# EAGLE design AJH_100m_ADSR_1_0 (EAGLE 9.5.2)
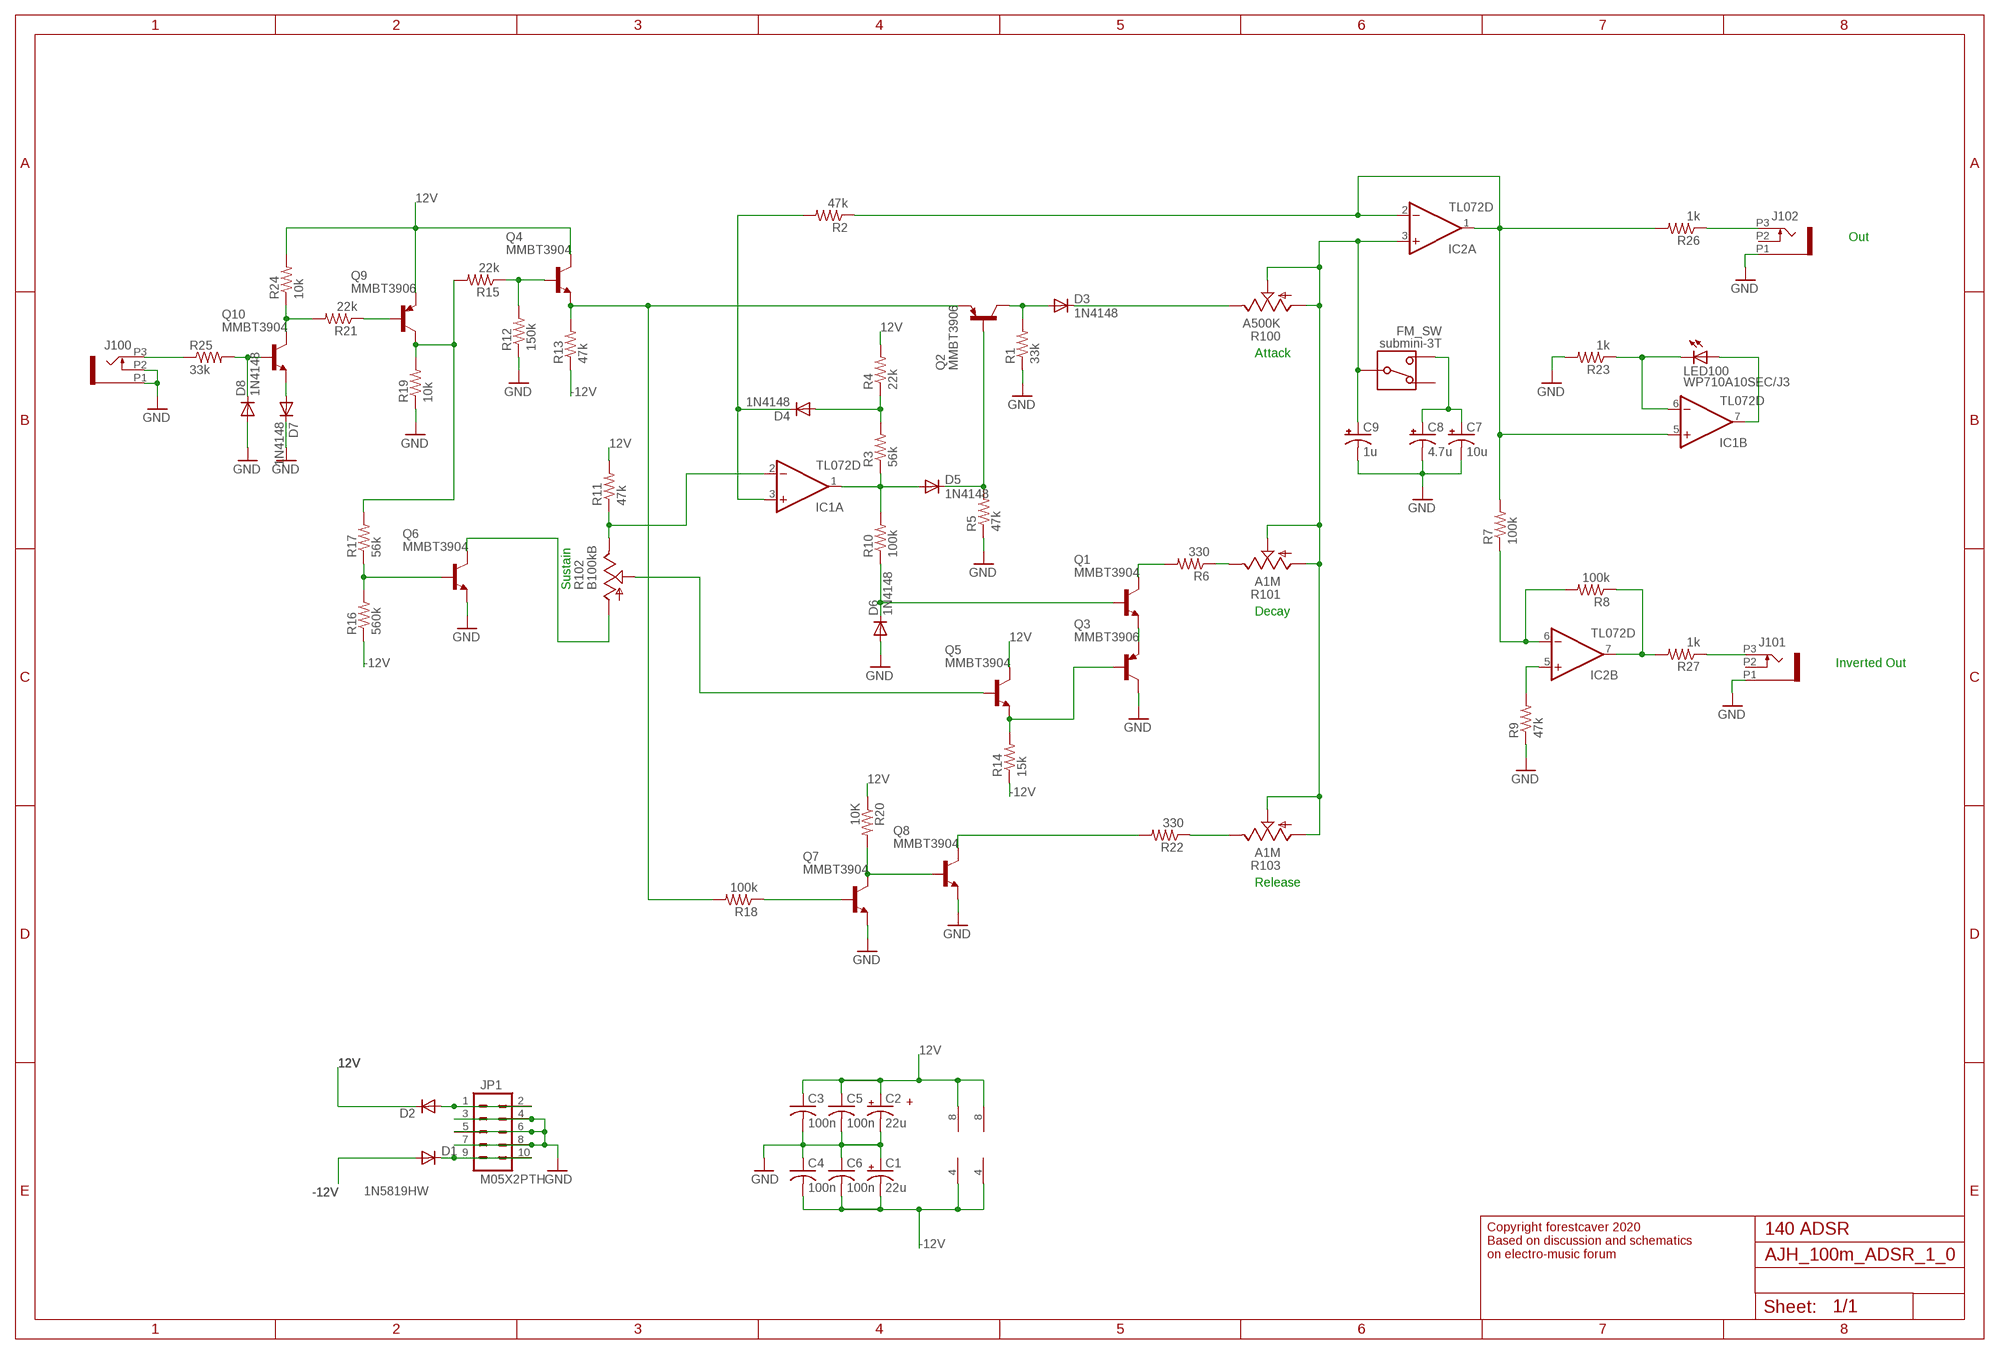
[diagram p0: schematic, sheet 1]

## Parts
C1  22u  CPOL-USB  [PANASONIC_B]
C2  22u  CPOL-USB  [PANASONIC_B]
C3  100n  C-USC0603  [C0603]
C4  100n  C-USC0603  [C0603]
C5  100n  C-USC0603  [C0603]
C6  100n  C-USC0603  [C0603]
C7  10u  CPOL-USB  [PANASONIC_B]
C8  4.7u  CPOL-USB  [PANASONIC_B]
C9  1u  CPOL-USB  [PANASONIC_B]
D1  1N5819HW  DIODE-SOD123  [SOD123]
D2  1N5819HW  DIODE-SOD123  [SOD123]
D3  1N4148  DIODE-SOD323-W  [SOD323-W]
D4  1N4148  DIODE-SOD323-W  [SOD323-W]
D5  1N4148  DIODE-SOD323-W  [SOD323-W]
D6  1N4148  DIODE-SOD323-W  [SOD323-W]
D7  1N4148  DIODE-SOD323-W  [SOD323-W]
D8  1N4148  DIODE-SOD323-W  [SOD323-W]
FM_SW  submini-3T  SPDTT  [SPDT-SUB]
IC1  TL072D  [SO08]
IC2  TL072D  [SO08]
J100  PJ301_THONKICONN6  [WQP_PJ_301M6]
J101  PJ301_THONKICONN6  [WQP_PJ_301M6]
J102  PJ301_THONKICONN6  [WQP_PJ_301M6]
JP1  M05X2PTH  [AVR_ICSP]
LED100  WP710A10SEC/J3  LED3MM  [LED3MM]
Q1  MMBT3904  MMBT3904LT1-NPN-SOT23-BEC  [SOT23-BEC]
Q2  MMBT3906  MMBT3906LT1-PNP-SOT23-BEC  [SOT23-BEC]
Q3  MMBT3906  MMBT3906LT1-PNP-SOT23-BEC  [SOT23-BEC]
Q4  MMBT3904  MMBT3904LT1-NPN-SOT23-BEC  [SOT23-BEC]
Q5  MMBT3904  MMBT3904LT1-NPN-SOT23-BEC  [SOT23-BEC]
Q6  MMBT3904  MMBT3904LT1-NPN-SOT23-BEC  [SOT23-BEC]
Q7  MMBT3904  MMBT3904LT1-NPN-SOT23-BEC  [SOT23-BEC]
Q8  MMBT3904  MMBT3904LT1-NPN-SOT23-BEC  [SOT23-BEC]
Q9  MMBT3906  MMBT3906LT1-PNP-SOT23-BEC  [SOT23-BEC]
Q10  MMBT3904  MMBT3904LT1-NPN-SOT23-BEC  [SOT23-BEC]
R1  33k  R-US_R0603  [R0603]
R2  47k  R-US_R0603  [R0603]
R3  56k  R-US_R0603  [R0603]
R4  22k  R-US_R0603  [R0603]
R5  47k  R-US_R0603  [R0603]
R6  330  R-US_R0603  [R0603]
R7  100k  R-US_R0603  [R0603]
R8  100k  R-US_R0603  [R0603]
R9  47k  R-US_R0603  [R0603]
R10  100k  R-US_R0603  [R0603]
R11  47k  R-US_R0603  [R0603]
R12  150k  R-US_R0603  [R0603]
R13  47k  R-US_R0603  [R0603]
R14  15k  R-US_R0603  [R0603]
R15  22k  R-US_R0603  [R0603]
R16  560k  R-US_R0603  [R0603]
R17  56k  R-US_R0603  [R0603]
R18  100k  R-US_R0603  [R0603]
R19  10k  R-US_R0603  [R0603]
R20  10K  R-US_R0603  [R0603]
R21  22k  R-US_R0603  [R0603]
R22  330  R-US_R0603  [R0603]
R23  1k  R-US_R0603  [R0603]
R24  10k  R-US_R0603  [R0603]
R25  33k  R-US_R0603  [R0603]
R26  1k  R-US_R0603  [R0603]
R27  1k  R-US_R0603  [R0603]
R100  A500K  POT_USVERTICAL  [ALPS_POT_VERTICAL]
R101  A1M  POT_USVERTICAL  [ALPS_POT_VERTICAL]
R102  B100kB  POT_USVERTICAL  [ALPS_POT_VERTICAL]
R103  A1M  POT_USVERTICAL  [ALPS_POT_VERTICAL]

## Nets
12V [power]: C2.+ C3.1 C5.1 D2.C IC1.8(P:V+) IC2.8(P:V+) Q4.C Q5.C Q9.E R4.2 R11.2 R20.1 R24.2
-12V [power]: C1.- C4.2 C6.2 D1.A IC1.4(P:V-) IC2.4(P:V-) R13.1 R14.1 R16.1
GND [power]: C1.+ C2.- C3.2 C4.1 C5.2 C6.1 C7.- C8.- C9.- D6.A D7.C D8.A J100.P1 J100.P2 J101.P1 J102.P1 JP1.3 JP1.4 JP1.5 JP1.6 JP1.7 JP1.8 Q3.C Q6.E Q7.E Q8.E R1.1 R5.1 R9.1 R12.1 R19.1 R23.2
N$1: IC1.6(B:-IN) LED100.K(C) R23.1
N$2: IC2.6(B:-IN) R7.1 R8.2
N$3: D4.A R3.2 R4.1
N$4: IC1.7(B:OUT) LED100.A
N$6: D2.A JP1.1 JP1.2
N$9: C7.+ C8.+ FM_SW.P$1
N$10: IC1.5(B:+IN) IC2.1(A:OUT) IC2.2(A:-IN) R2.1 R7.2 R26.2
N$11: J102.P3 R26.1
N$13: IC2.7(B:OUT) R8.1 R27.2
N$14: J100.P3 R25.1
N$15: IC2.5(B:+IN) R9.2
N$16: D8.C Q10.B R25.2
N$17: D7.A Q10.E
N$18: Q10.C R21.2 R24.1
N$19: Q9.B R21.1
N$20: D1.C JP1.9 JP1.10
N$21: Q9.C R15.2 R17.2 R19.2
N$23: Q2.E Q4.E R13.2 R18.2
N$24: Q4.B R12.2 R15.1
N$25: Q6.C R102.P$3(A)
N$26: Q6.B R16.2 R17.1
N$27: IC1.2(A:-IN) R11.1 R102.P$1(E)
N$28: D4.C IC1.3(A:+IN) R2.2
N$29: Q5.B R102.P$2(S)
N$30: D3.A Q2.C R1.2
N$31: D5.C Q2.B R5.2
N$32: D5.A IC1.1(A:OUT) R3.1 R10.2
N$33: D6.C Q1.B R10.1
N$34: Q1.E Q3.E
N$35: Q1.C R6.2
N$36: D3.C R100.P$1(E)
N$37: Q3.B Q5.E R14.2
N$38: C9.+ FM_SW.P$2 IC2.3(A:+IN) R100.P$2(S) R100.P$3(A) R101.P$2(S) R101.P$3(A) R103.P$2(S) R103.P$3(A)
N$40: J101.P3 R27.1
N$56: R6.1 R101.P$1(E)
N$57: Q7.C Q8.B R20.2
N$58: Q8.C R22.2
N$59: Q7.B R18.1
N$60: R22.1 R103.P$1(E)
Unconnected: FM_SW.P$3 J101.P2 J102.P2

## Notes on the sheet
- Out
- Attack
- Sustain
- Decay
- Inverted Out
- Release
- +
- Copyright forestcaver 2020
  Based on discussion and schematics
  on electro-music forum
- 140 ADSR

## Library data of the parts
C1 C2 C7-C9 = rcl:CPOL-US: POLARIZED CAPACITOR, American symbol
C3-C6 = rcl:C-US: CAPACITOR, American symbol
D1-D8 = diode:DIODE-: DIODE
FM_SW = malekko main:SPDT: SPDT Switch
IC1 IC2 = linear:TL072: OP AMP
J100-J102 = og-pj301_variations:PJ301_THONKICONN
JP1 = og-header:M05X2: Header 5x2 Standard 10-pin dual row 0.1" header. Commonly used with AVR-ISP. Use with Spark Fun Electronics SKU: PRT-00778
LED100 = led:LED: LED OSRAM: - CHIPLED LG R971, LG N971, LY N971, LG Q971, LY Q971, LO R971, LY R971 LH N974, LH R974 LS Q976, LO Q976, LY Q976 LO Q996 - Hyper CHIPLED LW Q18S LB Q993, LB Q99A, LB R99A - SideLED LS A670, LO A670, LY A670, LG A670, LP A670 LB A673, LV A673, LT A673, LW A673 LH A674 LY A675 LS A676, LA A676, LO A676, LY A676, LW A676 LS A679, LY A679, LG A679 - Hyper Micro SIDELED® LS Y876, LA Y876, LO Y876, LY Y876 LT Y87S - SmartLED LW L88C, LW L88S LB L89C, LB L89S, LG L890 LS L89K, LO L89K, LY L89K LS L896, LA L896, LO L896, LY L896 - TOPLED LS T670, LO T670, LY T670, LG T670, LP T670 LSG T670, LSP T670, LSY T670, LOP T670, LYG T670 LG T671, LOG T671, LSG T671 LB T673, LV T673, LT T673, LW T673 LH T674 LS T676, LA T676, LO T676, LY T676, LB T676, LH T676, LSB T676, LW T676 LB T67C, LV T67C, LT T67C, LS T67K, LO T67K, LY T67K, LW E67C LS E67B, LA E67B, LO E67B, LY E67B, LB E67C, LV E67C, LT E67C LW T67C LS T679, LY T679, LG T679 LS T770, LO T770, LY T770, LG T770, LP T770 LB T773, LV T773, LT T773, LW T773 LH T774 LS E675, LA E675, LY E675, LS T675 LS T776, LA T776, LO T776, LY T776, LB T776 LHGB T686 LT T68C, LB T68C - Hyper Mini TOPLED® LB M676 - Mini TOPLED Santana® LG M470 LS M47K, LO M47K, LY M47K Source: http://www.osram.convergy.de LUXEON: - LUMILED® LXK2-PW12-R00, LXK2-PW12-S00, LXK2-PW14-U00, LXK2-PW14-V00 LXK2-PM12-R00, LXK2-PM12-S00, LXK2-PM14-U00 LXK2-PE12-Q00, LXK2-PE12-R00, LXK2-PE12-S00, LXK2-PE14-T00, LXK2-PE14-U00 LXK2-PB12-K00, LXK2-PB12-L00, LXK2-PB12-M00, LXK2-PB14-N00, LXK2-PB14-P00, LXK2-PB14-Q00 LXK2-PR12-L00, LXK2-PR12-M00, LXK2-PR14-Q00, LXK2-PR14-R00 LXK2-PD12-Q00, LXK2-PD12-R00, LXK2-PD12-S00 LXK2-PH12-R00, LXK2-PH12-S00 LXK2-PL12-P00, LXK2-PL12-Q00, LXK2-PL12-R00 Source: www.luxeon.com KINGBRIGHT: KA-3528ASYC Source: www.kingbright.com
Q1 Q4-Q8 Q10 = transistor:*-NPN-: NPN Transistror BF959 corrected 2008.03.06
Q2 Q3 Q9 = transistor:*-PNP-: PNP Transistror
R1-R22 R24-R27 = resistor:R-US_: RESISTOR, American symbol
R23 = rcl:R-US_: RESISTOR, American symbol
R100-R103 = og-pots:POT_US

## Net classes
0 default: width 0.152 mm
1 power: width 0.406 mm
2 nearfilter: width 0.152 mm

## Board
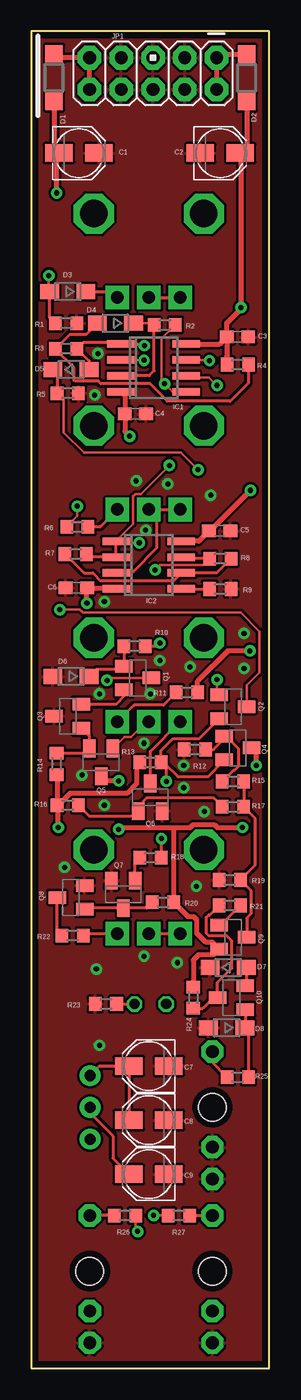
[diagram p1: board, top side]
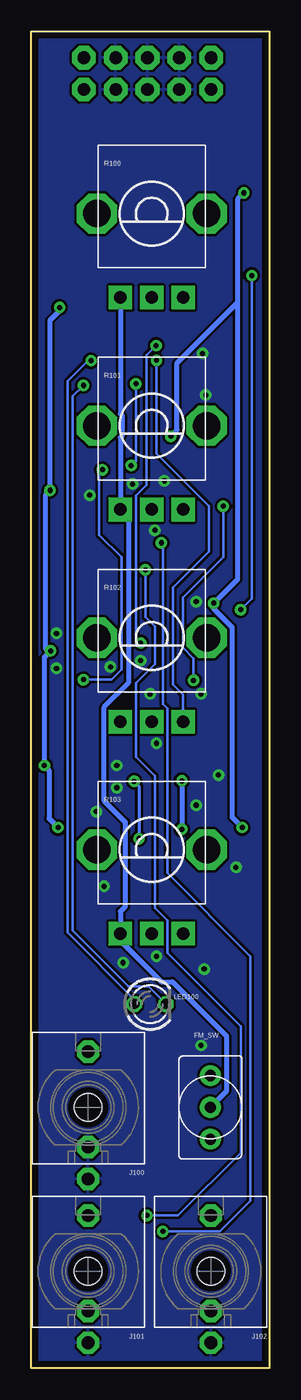
[diagram p2: board, bottom side, seen from below]

Size 19.03 x 106.76 mm. Coordinates in mm from the lower left corner, seen from the top.
Outline: 0,0 19.03,0 19.03,106.76 0,106.76 0,0
Copper layers (1*16): Top 0.035mm / dielectric 1.5mm / Bottom 0.035mm
Design rules "Mutable_PCBCart-Standard": minimum track width 8mil, minimum drill 0.4mm, track to track 8mil, track to pad 8mil, pad to pad 8mil, via to via 8mil, smd to smd 8mil, copper to edge 20mil, drill to drill 8mil, minimum pad ring 8mil, minimum via ring 10mil, stop-mask expansion 3mil, vias tented up to drill 25mil, thermal gap 8mil

### Footprints (pad centres in the part's own frame; a part is rotated, then mirrored left to right if it is on the bottom)
PANASONIC_B = smd 2.2 x 1.4: + 1.6,0; - -1.6,0
C0603 = smd 1.1 x 1: 1 -0.85,0; 2 0.85,0
SOD123 = smd 1.4 x 1.4: A 1.9,0; C -1.9,0
SOD323-W = smd 1.5 x 1.2: A 1.45,0; C -1.45,0
SPDT-SUB = drill 0.889 pad 1.651: P$1 0,2.54; P$2 0,0; P$3 0,-2.54
SO08 = smd 0.6 x 2.2: 1 -1.905,-2.6; 2 -0.635,-2.6; 3 0.635,-2.6; 4 1.905,-2.6; 5 1.905,2.6; 6 0.635,2.6; 7 -0.635,2.6; 8 -1.905,2.6
WQP_PJ_301M6 = drill 1.016 pad 1.778 octagon: P1 0,-5.715; P2 0,-3.175; P3 0,4.445 | hole 2.2: 0,0
AVR_ICSP = drill 1.016 pad 1.88 octagon: 1 -1.27,5.08; 2 1.27,5.08; 3 -1.27,2.54; 4 1.27,2.54; 5 -1.27,0; 6 1.27,0; 7 -1.27,-2.54; 8 1.27,-2.54; 9 -1.27,-5.08; 10 1.27,-5.08
LED3MM = drill 0.813 octagon: A -1.27,0; K 1.27,0
SOT23-BEC = smd 1 x 1.4: B -0.95,-1.1; C 0,1.1; E 0.95,-1.1
R0603 = smd 1 x 1.1: 1 -0.85,0; 2 0.85,0
ALPS_POT_VERTICAL = drill 1 pad 1.88 square: P$1 -2.5,6.7; P$2 0,6.7; P$3 2.5,6.7 | drill 2.2 pad 3.175 octagon: P$4 -4.4,0; P$5 4.4,0

### Placement (x,y rotation side)
C1  3.81,97.03 0 top
C2  15.11,97.03 0 top
C3  16.49,82.35 0 top
C4  8.33,76.2 180 top
C5  15.06,66.87 0 top
C6  3.6,62.31 0 top
C7  9.4,24.13 180 top
C8  9.4,19.81 180 top
C9  9.4,15.49 180 top
D1  1.83,103.06 270 top
D2  17.23,103.04 90 top
D3  2.92,85.98 180 top
D4  6.73,83.44 180 top
D5  3.17,79.76 0 top
D6  3.17,55.24 180 top
D7  15.75,32 0 top
D8  15.62,27.18 180 top
FM_SW  4.7,20.83 0 bottom
IC1  9.78,79.88 270 top
IC2  9.4,64.14 270 top
J100  14.48,20.83 0 bottom
J101  14.48,7.75 0 bottom
J102  4.67,7.75 0 bottom
JP1  9.74,103.38 270 top
LED100  9.53,29.08 0 bottom
Q1  8.51,55.12 270 top
Q2  16.13,52.83 270 top
Q3  2.92,52.07 90 top
Q4  16.51,49.53 270 top
Q5  5.59,48.39 180 top
Q6  9.53,45.59 0 top
Q7  7.37,37.85 180 top
Q8  3.17,37.59 90 top
Q9  16.13,34.42 270 top
Q10  16,29.59 90 top
R1  2.79,83.44 180 top
R2  10.67,83.31 180 top
R3  2.79,81.41 180 top
R4  16.51,80.14 180 top
R5  2.92,77.85 180 top
R6  3.68,67.18 180 top
R7  3.56,65.02 0 top
R8  15.11,64.64 0 top
R9  15.11,62.23 180 top
R10  8.26,57.66 0 top
R11  12.45,53.98 0 top
R12  13.08,49.4 0 top
R13  9.53,48.39 0 top
R14  2.03,48.26 90 top
R15  16.13,46.86 0 top
R16  2.92,44.96 0 top
R17  16.13,44.83 0 top
R18  9.53,40.77 0 top
R19  15.88,38.99 0 top
R20  10.54,37.21 180 top
R21  15.88,36.96 180 top
R22  3.3,34.54 180 top
R23  5.97,29.08 180 top
R24  12.95,29.59 90 top
R25  16.51,23.24 0 top
R26  7.49,12.19 0 top
R27  11.81,12.19 180 top
R100  9.4,92.2 180 bottom
R101  9.4,75.27 180 bottom
R102  9.4,58.34 180 bottom
R103  9.4,41.4 180 bottom

### Tracks (layer width: path | path; a pad name or v marks a point on that pad's centre or on a via)
12V  (via drill 0.4)
  Top 0.406: D2.C 17.23,97.54 C2.+ 16.76,96.98 v16.76,84.71 16.76,84.58 15.64,83.46 C3.1 | IC2.8 13.39,66.04 C5.1 14.29,66.87 v17.53,70.1 | v17.53,70.1 | R11.2 13.3,54.87 15.71,57.28 v17.49,57.28 | v17.99,48.13 17.99,49.15 Q4.C | C3.1 15.64,80.79 15.66,80.77 R4.2 | C3.1 15.08,81.79 IC1.8 | v6.99,46.91 5.96,46.91 Q5.C | v6.99,43.03 7.13,43.18 11.43,43.18 | 11.43,43.18 12.73,43.18 12.96,43.42 14.63,43.42 14.87,43.18 v16.89,43.18 | 11.43,43.18 11.39,43.14 R20.1 12.55,36.05 13.01,36.05 13.24,35.81 13.24,34.73 13.97,34 14.49,34 Q9.E 14.57,33.01 13.38,33.01 12.95,32.59 R24.2
  Bottom 0.406: v16.76,84.71 16.76,84.45 17.53,83.69 v17.53,70.1 17.91,69.72 17.91,57.49 17.69,57.28 v17.49,57.28 17.99,56.77 v17.99,48.13 17.61,47.75 17.61,43.9 v16.89,43.18 | v6.99,46.91 v6.99,43.03
-12V  (via drill 0.4)
  Top 0.406: D1.A 1.83,97.41 C1.- 2.03,96.85 v2.03,93.85 | IC1.4 7.48,77.68 C4.2 7.49,76.19 7.49,74.8 v7.87,74.42 | IC2.4 6.71,62.31 C6.2 v4.45,61.09 | R14.1 2.07,47.37 R16.1 2.15,44.96 | R13.1 8.42,48.13 8.42,46.69 7.64,45.91 3.1,45.91 2.15,44.96 | v2.16,43.18 2.15,43.19 2.15,44.96
  Bottom 0.406: 2.54,85.09 7.37,80.26 7.37,74.93 v7.87,74.42 | v2.03,93.85 2.54,93.34 2.54,85.09 | 2.54,85.09 2.54,62.99 v4.45,61.09 4.45,60.63 2.98,59.17 2.98,44.01 v2.16,43.18
GND  (via drill 0.41)
  other vias: 2.67,40.01 12.19,46.35 13.84,44.45 5.21,31.88 5.46,25.78 11.68,32.38 9.02,32.89 12.19,48.13 14.35,69.72 8.38,70.87 5.84,61.21 17.02,58.67 17.02,55.88 10.29,56.52 4.06,47.37 5.08,77.72 13.21,38.48 12.7,56.01 5.46,53.85 9.14,66.93 5.33,81.03 9.02,49.91 5.84,44.96 9.53,53.85 10.92,70.61
  pour Top: -0.89,107.7 19.43,107.7 20.07,107.06 20.32,106.81 20.32,-0.25 19.3,-1.27 -0.25,-1.27 -0.89,-0.64
  pour Bottom: -1.4,108.33 20.07,108.33 20.07,-0.64 -1.14,-0.64 -1.4,-0.38
N$1  (via drill 0.4)
  Top 0.203: IC1.6 12.51,79.12 14.22,79.12 v14.86,78.49
  Top 0.254: R23.1 LED100.K
  Bottom 0.203: v14.86,78.49 15.71,77.63 15.71,34.96 11.23,30.48 9.65,30.48 LED100.K
N$2
  Top 0.254: R8.2 14.82,63.5 IC2.6 11.37,62.87 5.56,62.87 4.93,63.5 4.23,63.5 R7.1
N$3
  Top 0.254: D4.A 4.41,82.56 3.1,82.56 R3.2 1.93,81.39 3.42,79.89 3.42,78.89 3.48,78.83 5.35,78.83 5.56,78.62 9.49,78.62 10.89,77.22 15.91,77.22 17.36,78.67 R4.1
N$4  (via drill 0.4)
  Top 0.203: IC1.7 14.19,80.52 v14.25,80.46
  Bottom 0.203: v14.25,80.46 14.5,80.46 16.13,78.83 16.13,34.8 10.79,29.46 LED100.A
N$6
  Top 0.406: JP1.2 JP1.1 15.11,104.94 D2.A
N$9
  Top 0.254: C8.+ C7.+ 5.46,24.13 FM_SW.P$1
N$10  (via drill 0.4)
  Top 0.203: IC1.5 11.31,77.98 v10.68,78.61 v10.67,78.61 10.41,78.87 10.41,82.21 R2.1 | IC2.1 8.15,67.39 8.15,69.64 8.33,69.81 8.76,69.81 v11.04,72.09 | v8.51,10.92 8.34,11.09 R26.2 | v8.64,65.91 6.8,65.91
  Top 0.254: R7.2 4.66,64.77 IC2.2 6.8,65.91 IC2.1
  Bottom 0.203: v10.67,78.61 10.67,72.46 v11.04,72.09 | v8.64,65.91 8.51,65.79 8.51,53.06 8.15,52.7 8.15,39.54 1.5,32.88 1.5,13.36 3.94,10.92 v8.51,10.92
N$11
  Top 0.254: R26.1 J102.P3
N$13  (via drill 0.4)
  Top 0.203: R8.1 13.76,64.14 10.29,64.14 v9.91,63.75 | v9.78,12.19 R27.2
  Top 0.254: IC2.7 12.12,64.64 R8.1
  Bottom 0.203: v9.91,63.75 9.91,60 9.15,59.24 9.15,56.23 10.64,54.73 10.64,48.79 9.14,47.29 9.14,36.76 8.15,35.77 8.15,33.16 2.29,27.3 2.29,17.2 7.29,12.19 v9.78,12.19
N$14
  Top 0.254: R25.1 14.48,24.42 J100.P3
N$15
  Top 0.254: IC2.5 R9.2
N$16
  Top 0.254: Q10.B 17.1,27.21 D8.C 17.36,26.89 R25.2
N$17
  Top 0.254: D7.A 17.2,30.64 Q10.E
N$18
  Top 0.254: R24.1 13.72,28.74 14.57,29.59 Q10.C 14.9,30.79 16.06,31.95 16.06,34.1 15.63,34.54 14.19,34.54 14,34.73 14,36 14.19,36.2 14.27,36.2 R21.2
N$19
  Top 0.254: R21.1 15.13,35.37 Q9.B
N$20
  Top 0.406: D1.C 2.14,104.65 JP1.9 JP1.10
N$21
  Top 0.254: Q9.C 17.23,35.94 17.55,36.27 17.55,38.16 R19.2 17.87,40.13 17.87,43.94 R17.2 R15.2
N$23  (via drill 0.4)
  Top 0.254: Q4.E 15.41,48.51 14.15,47.25 11.72,47.25 10.59,48.39 10.54,48.39 | 10.54,48.39 R13.2 10.38,49.32 11.34,50.28 13.43,50.28 Q2.E | R18.2 10.41,40.81 v10.41,42.29 | v10.79,46.86 10.79,48.13 10.54,48.39
  Bottom 0.254: v10.79,46.86 10.41,46.48 v10.41,42.29
N$24
  Top 0.254: R12.2 14.57,49.4 15.41,50.25 Q4.B 15.56,50.48 16.57,49.47 16.57,48.07 16.25,47.75 16.17,47.75 R15.1
N$25
  Top 0.254: Q6.C 9.53,49.26 R102.P$3
N$26
  Top 0.254: R16.2 4.66,44.07 8.15,44.07 Q6.B 8.57,44.87 9.22,45.52 14.59,45.52 R17.1
N$27  (via drill 0.4)
  Top 0.203: IC1.2 7.21,80.49 v9.02,80.49
  Top 0.254: R11.1 10.58,52.96 8.22,52.96 R102.P$1
  Bottom 0.203: v9.02,80.49 9.02,73.04 4.83,68.85 4.83,65.22 7.7,62.35 7.7,54.62 6.9,53.82 R102.P$1
N$28
  Top 0.203: D4.C 9.69,83.44 R2.2
  Top 0.254: IC1.3 9.43,79.25 9.83,79.65 9.83,83.3 R2.2
N$29
  Top 0.203: Q5.B 7.44,50.39 7.96,50.39 9.21,51.63 R102.P$2
N$30  (via drill 0.4)
  Top 0.203: D3.A 1.4,86.05 v1.4,87.25 | v2.29,60.58 3.88,60.58 4.13,60.33 16.76,60.33 18.24,58.84 18.24,55.57 17.23,54.55 Q2.C
  Top 0.254: R1.2 1.47,83.91 D3.A
  Bottom 0.203: v1.4,87.25 1.4,61.47 v2.29,60.58
N$31  (via drill 0.4)
  Top 0.203: v13.34,71.75 11.99,73.1 4.21,73.1 2.58,74.73 2.58,77.34 R5.2 | v14.86,54.99 14.86,53.95 Q2.B
  Top 0.254: D5.C 2.07,79.41 R5.2
  Bottom 0.203: v13.34,71.75 13.59,71.5 13.59,66.55 11.81,64.77 11.81,55.79 12.61,54.99 v14.86,54.99
N$32  (via drill 0.4)
  Top 0.254: D5.A 4.62,80.43 R3.1 4.15,81.92 7.05,81.92 IC1.1 8.92,81.79 v9.05,81.66 | v10.29,57.91 10.03,57.66 R10.2
  Bottom 0.203: v10.29,57.91 10.67,58.29 10.67,67.49 10.65,67.5 10.65,69.7 9.81,70.54 9.81,80.9 v9.05,81.66
N$33
  Top 0.254: D6.C 5.19,55.81 7.16,55.81 Q1.B R10.1
N$34
  Top 0.254: Q1.E 7.41,53.66 6.77,53.02 Q3.E
N$35  (via drill 0.4)
  Top 0.203: Q1.C 6.24,55.12 v6.05,54.93 | v3.68,68.83 3.68,68.03 R6.2
  Bottom 0.203: v6.05,54.93 6.05,56.68 6.91,57.54 6.91,61.54 3.68,64.77 v3.68,68.83
N$36
  Top 0.254: D3.C 6.42,85.98 R100.P$1
N$37
  Top 0.254: Q3.B 4.64,50.5 Q5.E 4.64,49.11 R14.2
N$38
  Top 0.254: C9.+ 6.53,16.76 6.53,18.54 4.7,20.37 FM_SW.P$2 | R103.P$2 R103.P$3 | R101.P$3 R101.P$2 10.03,67.93 10.03,65.5 8.16,63.63 6.93,63.63 IC2.3 | R100.P$2 R100.P$3
  Bottom 0.406: R100.P$3 11.9,76.22 11.78,76.1 11.78,74.43 11.9,74.32 R101.P$3 11.26,67.93 11.26,54.73 13.24,52.74 13.24,45.35 11.53,43.63 11.53,36.85 11.9,36.48 R103.P$3 11.9,34.12 8.64,30.86 7.75,30.86 3.43,26.54 3.43,22.1 FM_SW.P$2
N$40
  Top 0.254: R27.1 J101.P3
N$56
  Top 0.254: R101.P$1 5.51,67.18 R6.1
N$57
  Top 0.254: R20.2 9.23,36.75 Q7.C 4.38,36.75 Q8.B
N$58
  Top 0.254: R22.2 2.08,34.92 Q8.C
N$59
  Top 0.254: Q7.B 8.32,40.41 R18.1
N$60
  Top 0.254: R22.1 4.31,34.7 R103.P$1

### Text on the board
tDocu: 140 ADSR v1.0 Copyright forestcaver 2020